# Altium schematic sheet MP8756GD_4.SchDoc
size A4; SheetNumber: 14; SheetTotal: 16
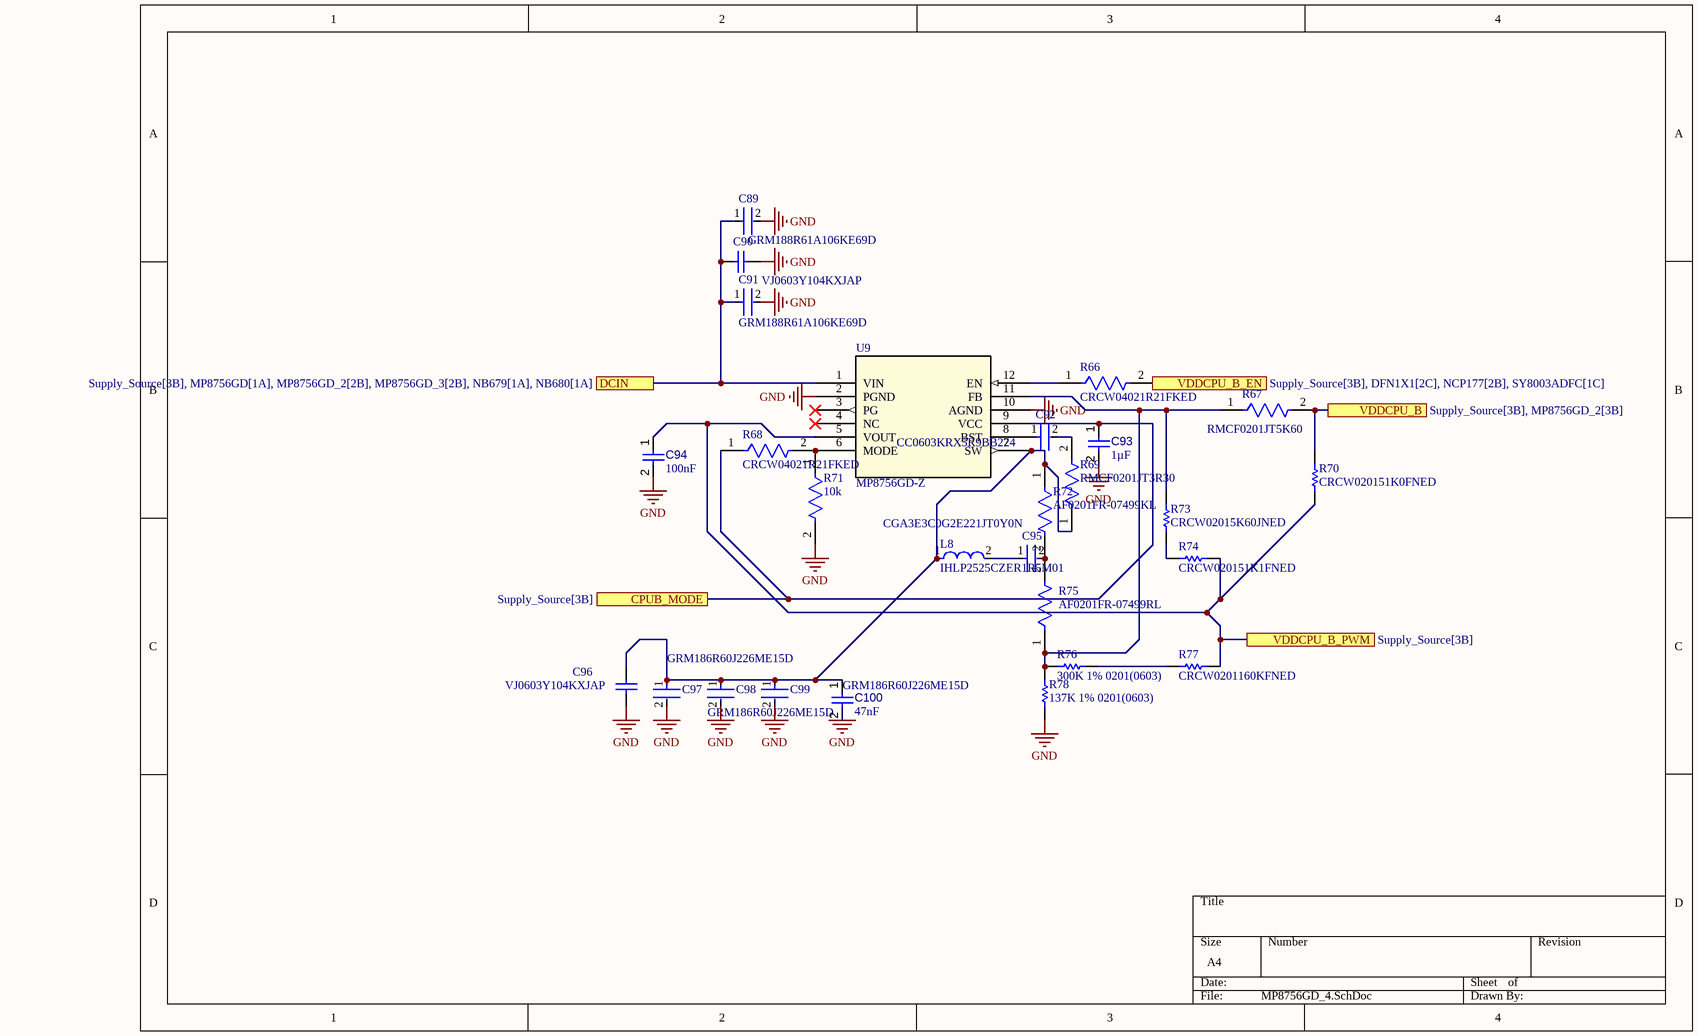
[diagram p0: MP8756GD_4.SchDoc]

## Parts
C89  GRM188R61A106KE69D  [FP-GRM18-0_15-MFG]
C90  VJ0603Y104KXJAP  [CAPC1608X92X38NL15T08]
C91  GRM188R61A106KE69D  [FP-GRM18-0_15-MFG]
C92  CC0603KRX5R9BB224  [FP-CC0603-DA-MFG]
C93  value 1µF  [CAPC1005X55X25LL05T10]  (hidden comment: Capacitor 1 uF +/- 10% 6.3 V 0402)
C94  value 100nF  [CAPC1005X56X25LL10T15]  (hidden comment: Capacitor 0.1 uF +/- 5% 16 V 0402)
C95  CGA3E3C0G2E221JT0Y0N  [FP-CGA3E-0_3-0_1-IPC_B]
C96  VJ0603Y104KXJAP  [CAPC1608X92X38NL15T08]
C97  GRM186R60J226ME15D  [FP-GRM186-0_2-IPC_B]
C98  GRM186R60J226ME15D  [FP-GRM186-0_2-IPC_B]
C99  GRM186R60J226ME15D  [FP-GRM186-0_2-IPC_B]
C100  value 47nF  [CAPC0402(1005)60_L]  (hidden comment: Capacitor 47nF +/-20% 50V 0402)
L8  IHLP2525CZER1R5M01  [FP-IHLP-2525CZ-FP_2_413x3-MFG]
R66  CRCW04021R21FKED  [FP-CRCW0402-e3-MFG]
R67  RMCF0201JT5K60  [FP-RMCF0201-MFG]
R68  CRCW04021R21FKED  [FP-CRCW0402-e3-MFG]
R69  RMCF0201JT3R30  [FP-RMCF0201-IPC_A]
R70  CRCW020151K0FNED  [RESC0603X28X15LL05T05]
R71  value 10k  [FP-RT0201-IPC_C]  (hidden comment: RT0201BRE0710KL)
R72  AF0201FR-07499KL  [FP-AF0201-MFG]
R73  CRCW02015K60JNED  [RESC0603X28X15NL05T05]
R74  CRCW020151K1FNED  [RESC0603X28X15ML05T05]
R75  AF0201FR-07499RL  [FP-AF0201-IPC_A]
R76  300K 1% 0201(0603)  [RESC0201(0603)_L]
R77  CRCW0201160KFNED  [RESC0603X28X15ML05T05]
R78  137K 1% 0201(0603)  [RESC0201(0603)_M]
U9  MP8756GD-Z  [QFN-12_MP8756_MNP]

## Ports
CPUB_MODE (see Supply_Source[3B]), DCIN (see Supply_Source[3B], MP8756GD[1A], MP8756GD_2[2B], MP8756GD_3[2B], NB679[1A], NB680[1A]), VDDCPU_B (see Supply_Source[3B], MP8756GD_2[3B]), VDDCPU_B_EN (see Supply_Source[3B], DFN1X1[2C], NCP177[2B], SY8003ADFC[1C]), VDDCPU_B_PWM (see Supply_Source[3B])

## Nets
GND: C89.2 C90.1 C91.2 C93.2 C94.2 C96.1 C97.2 C98.2 C99.2 C100.2 R71.2 R78.1 U9.2(PGND) U9.10(AGND)
CPUB_MODE: C93.1 R68.1 U9.9(VCC) ; port CPUB_MODE
DCIN: C89.1 C90.2 C91.1 U9.1(VIN) ; port DCIN
VDDCPU_B: R67.2 R70.1 ; port VDDCPU_B
VDDCPU_B_EN: R66.2 ; port VDDCPU_B_EN
VDDCPU_B_PWM: C94.1 R70.2 R74.2 R77.2 U9.5(VOUT) ; port VDDCPU_B_PWM
NetC92_1: C92.1 U9.8(BST)
NetC92_2: C92.2 R69.2
NetC95_1: C95.1 L8.2
NetC95_2: C95.2 R72.2 R75.2
NetC96_2: C96.2 C97.1 C98.1 C99.1 C100.1 L8.1 R69.1 R72.1 U9.7(SW)
NetR66_1: R66.1 U9.12(EN)
NetR67_1: R67.1 R73.1 R75.1 R76.1 R78.2 U9.11(FB)
NetR68_2: R68.2 R71.1 U9.6(MODE)
NetR73_2: R73.2 R74.1
NetR76_2: R76.2 R77.1

Not connected (* = marked no-connect by the designer): U9 3(PG)* 4(NC)*

## Library data of the parts
C89 C91 = CMP-2000-05448-2: CAP CER 10UF 10V X5R 0603; Manufacturer: Murata; Temperature Coefficient: 15%; Material: Ceramic; Tolerance: 10%; Device Class L1: Passive Components; ComponentLink2Description: Datasheet; Height: 0.95mm; Package: GRM18-0.15; Octopart: https://octopart.com/grm188r61a106ke69d-murata-22851381; Manufacturer Part Number: GRM188R61A106KE69D; Value: 10uF; Digikey Description: CAP CER 10UF 10V X5R 0603; Temperature Range High: +85°C; Temperature Range Low: -55°C; Temperature Characteristic: X5R; Capacitance: 10uF; RoHS: TRUE; Device Class L2: Capacitors; ComponentLink2URL: https://search.murata.co.jp/Ceramy/image/img/A01X/G101/ENG/GRM188R61A106KE69-01A.pdf; Device Class L3: Ceramic Capacitors; Lead Free: Yes; Mouser Description: Multilayer Ceramic Capacitors MLCC - SMD/SMT 0603 10uF 10volts X5R + - 10%; Category: Cap; Voltage Rating: 10V; Temperature: -55°C to +85°C; Automotive: No
C90 C96 = CMP-2006-01211-1: Manufacturer: Vitramon; Part Number: VJ0603Y104KXJAP
C92 = CMP-03422-000839-1: CC0603 220 nF X5R 10.00% 50 V; Manufacturer: YAGEO; Tolerance: 0.1; Capacitance: 220 nF; Temperature Coefficient: 15%; Material: Ceramic; Voltage Rating: 50 V; Value: 220 nF; Package: CC0603-DA; Temperature: -55°C to +125°C; Automotive: No; ComponentLink2URL: http://www.yageo.com/documents/recent/UPY-GPHC_X7R_6.3V-to-50V_18.pdf; Device Class L1: Passive Components; Footprint Url: http://www.yageo.com/exep/pages/download/literatures/UPY-C_GEN_24.pdf; Mouser Description: Surface Mount Ceramic Multilayer Capacitor 0.22uF 10% X5R 50V 0603 Paper T/R; Temperature Range Low: -55°C; ComponentLink2Description: Datasheet; Temperature Characteristic: X5R; Category: Cap; Octopart: https://octopart.com/cc0603krx5r9bb224-yageo-90326743; Device Class L3: Ceramic Capacitors; RoHS: TRUE; Device Class L2: Capacitors; Height: 0.9mm; Manufacturer Part Number: CC0603KRX5R9BB224; Temperature Range High: +125°C; Voltage: 50 V; Lead Free: Yes
C93 = CMP-001-00008-6: Chip Capacitor, 1 uF, +/- 10%, 6.3 V, 0402 (1005 Metric); Capacitor Type: Ceramic; Voltage Rating: 6.3V; Max Operating Temperature: 85°C; Mounting Technology: SM; Tolerance: 10%; Case/Package: 0402; RoHS Compliant: True; Min Operating Temperature: -55°C; Pins: 2
C94 = CMP-001-00001-6: Chip Capacitor, 0.1 uF, +/- 5%, 16 V, 0402 (1005 Metric); Capacitor Type: Ceramic; Voltage Rating: 16V; Max Operating Temperature: 125°C; Min Operating Temperature: -55°C; Case/Package: 0402; Mounting Technology: SM; Pins: 2; Tolerance: 5%; RoHS Compliant: True
C95 = CMP-08246-002038-1: Cap Ceramic 220pF 250V C0G 5% Pad SMD 0603 +125°C Automotive T/R
C97-C99 = CMP-06035-038491-1: Chip Multilayer Ceramic Capacitors for General Purpose, 0603, 22uF, X5R, 15%, 20%, 6.3V; Mount: Surface Mount; Thickness: 0.028inch; Tolerance: 20%; Width: 0.031inch; Voltage Rating (DC): 6.3V; Min Operating Temperature: -55°C; Voltage Rating: 6.3V; Capacitance: 22uF; Dielectric: X5R; Case Code (Imperial): 0603; Length: 0.063inch; Case/Package: 0603; Packaging: Tape and Reel; Case Code (Metric): 1608; Max Operating Temperature: 85°C
C100 = CMP-001-00071-4: Chip Capacitor, 47nF +/-20%, 50V, 0402, Thickness 0.6 mm; Tolerance: 20%; Pins: 2; Mounting Technology: SMT; Voltage Rating: 50V; Case/Package: 0402; Max Operating Temperature: 85°C; Min Operating Temperature: -55°C
L8 = CMP-2000-06441-2: Commercial Inductors, High Saturation Series 1.5uH 9A 15mΩ 20%; DC Resistance (DCR): 15mR; Shielding: Shielded; Self Resonant Frequency: 5MHz; Max DC Current: 18A; Test Frequency: 100kHz; Core Material: Metal; Packaging: Tape and Reel; RMS Current (Irms): 9A; Length: 7.24mm; Case Code (Imperial): 2525; Case/Package: 2525; Min Operating Temperature: -55°C; Number of Pins: 2; Contact Plating: Tin; Height: 3mm; Height - Seated (Max): 0.118inch; Termination: SMD/SMT; Max Operating Temperature: 125°C; Depth: 6.72mm; Width: 6.47mm; Current Rating: 9A; Tolerance: 20%; Lead Free: Lead Free; Military Standard: Not; Radiation Hardening: No; Saturation Current: 18A; Package Quantity: 2000; Inductance Tolerance: 20%; Inductance: 1.5uH; Mount: Surface Mount
R66 R68 = CMP-2002-00308-2: RES Thick Film, 1.21Ω, 1%, 0.063W, 100ppm/°C, 0402; Power Rating: 63mW; Voltage Rating: 50V; Resistance: 1.21R; Height: 0.016inch; Length: 0.039inch; Temperature Coefficient: 100ppm/°C; Case/Package: 0402; Package Quantity: 10; Case Code (Metric): 1005; Radiation Hardening: No; Min Operating Temperature: -55°C; Tolerance: 1%; Weight: 2.3E-05oz; Max Power Dissipation: 63mW; Packaging: Tape and Reel; Composition: Thick Film; Contact Plating: Tin; Termination: SMD/SMT; Case Code (Imperial): 0402; Width: 0.5mm; Features: Automotive AEC-Q200; Number of Terminations: 2; Lead Free: Lead Free; Max Operating Temperature: 155°C
R67 = CMP-26527-005560-1: 5.6kΩ ±5% 0.05W 0201 Thick Film Chip Resistor AEC-Q200 compliant; Max Power Dissipation: 50mW; Resistance: 5.6kR; Temperature Coefficient: 200ppm/°C; Case/Package: 0201; Case Code (Imperial): 0201; Resistor Type: Thick Film; Min Operating Temperature: -55°C; Width: 0.012inch; Contact Plating: Tin; RoHS Compliant: Yes; Packaging: Tape and Reel; Radiation Hardening: No; Case Code (Metric): 0603; Mount: Surface Mount; Length: 0.024inch; Tolerance: 5%; Number of Terminations: 2; Series: RMCF; Max Operating Temperature: 125°C; Height: 0.009inch
R69 = CMP-26527-006332-1: 3.3Ω ±5% 0.05W 0201 Thick Film Chip Resistor AEC-Q200 compliant; Temperature Coefficient: 400ppm/°C; Resistance: 3.3R; Max Power Dissipation: 50mW; Mount: Surface Mount; Resistor Type: Thick Film; Series: RMCF; Tolerance: 5%; Contact Plating: Tin; Max Operating Temperature: 125°C; Radiation Hardening: No; Min Operating Temperature: -55°C; Height: 0.009inch; Number of Terminations: 2; Packaging: Tape and Reel; RoHS Compliant: Yes; Length: 0.024inch; Width: 0.012inch; Case/Package: 0201
R70 = CMP-2004-00692-1: Manufacturer: Vishay Dale; Part Number: CRCW020151K0FNED
R71 = CMP-009-00210-1: Fixed Resistor, Thin Film, 0.05W, 10000ohm, 25V, 0.1% +/-Tol, 50ppm/Cel, Surface Mount, 0201; Max Operating Temperature: 125°C; Min Operating Temperature: -55°C; Case/Package: 0201; Mounting Technology: Surface Mount; Voltage Rating: 25V; Tolerance: 0.1%
R72 = CMP-03412-049532-1: Anti-Sulfurated Chip Resistors Automotive Grade 499kΩ 1% 200ppm/°C 0201; Resistance: 499kR; Max Power Dissipation: 50mW; Packaging: Tape and Reel; Height: 0.01inch; Temperature Coefficient: 200ppm/°C; Width: 0.012inch; Case/Package: 0201; Max Operating Temperature: 125°C; Features: Moisture Resistant; Series: AF; Resistor Type: Thick Film; Min Operating Temperature: -55°C; Length: 0.024inch; Tolerance: 1%; Number of Terminations: 2; RoHS Compliant: Yes
R73 = CMP-2004-00746-1: Manufacturer: Vishay Dale; Part Number: CRCW02015K60JNED
R74 = CMP-2004-00695-1: Manufacturer: Vishay Dale; Part Number: CRCW020151K1FNED
R75 = CMP-03412-047469-1: Anti-Sulfurated Chip Resistors Automotive Grade 499Ω 1% 200ppm/°C 0201; Max Power Dissipation: 50mW; Resistance: 499R; Min Operating Temperature: -55°C; Height: 0.01inch; Features: Moisture Resistant; Resistor Type: Thick Film; Temperature Coefficient: 200ppm/°C; Width: 0.012inch; Case/Package: 0201; Number of Terminations: 2; Max Operating Temperature: 125°C; Packaging: Tape and Reel; Series: AF; RoHS Compliant: Yes; Tolerance: 1%; Length: 0.024inch
R76 = CMP-1010-00694-1: 300K 0.05W 1% 0201 (0603 Metric)  SMD; Case-Metric: 0603; Value: 300000.00 Ohm; Case-EIA: 0201; Power: 0.05 W; Technology: SMT; Tolerance: 1 %
R77 = CMP-2004-00140-1: Manufacturer: Vishay Dale; Part Number: CRCW0201160KFNED
R78 = CMP-1010-00656-1: 137K 0.05W 1% 0201 (0603 Metric)  SMD; Value: 137000.00 Ohm; Case-EIA: 0201; Case-Metric: 0603; Power: 0.05 W; Tolerance: 1 %; Technology: SMT
U9 = CMP-006-000002-1: 26V 6A Low IQ High-Current Synchronous Step-Down Converter; Manufacturer_Name: Monolithic Power Systems; Design Item ID: MP8756GD-Z; RefDes: RefDes; Manufacturer_Part_Number: MP8756GD-Z; Copyright: Copyright (C) 2025 Ultra Librarian. All rights reserved.; Type: Type; Source: MP8756GD-Z.SchLib